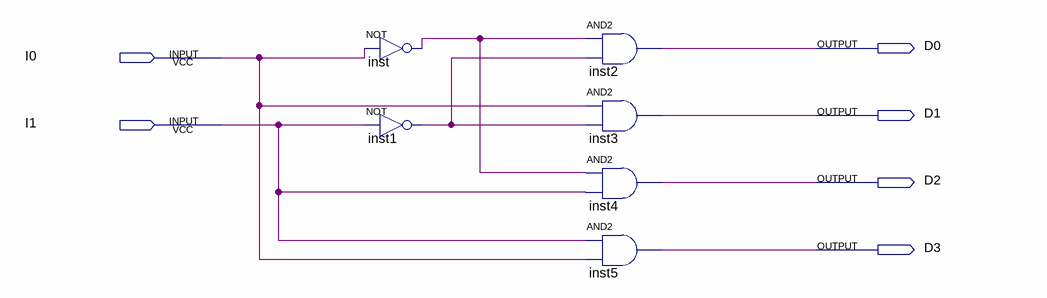
[diagram p0: schematic sheet]
// Quartus schematic Two_Bit_Decoder.bdf as structural Verilog: 6 symbols, 6 pins
module Two_Bit_Decoder (
  input  I0,
  input  I1,
  output D0,
  output D1,
  output D2,
  output D3
);

  wire inst1_out, inst_out;

  not inst (inst_out, I0);
  not inst1 (inst1_out, I1);
  and inst2 (D0, inst_out, inst1_out);
  and inst3 (D1, I0, inst1_out);
  and inst4 (D2, inst_out, I1);
  and inst5 (D3, I1, I0);
endmodule
